# Altium project display.PrjPcb (part 2 of 2)

## Sheet wifi.schdoc
size A3; Hw_rev: 0; License: GPLv3; Address3: Firenze; Address4: ITALY; DocumentNumber: 7; Revision: 0; SheetNumber: 7; SheetTotal: 8
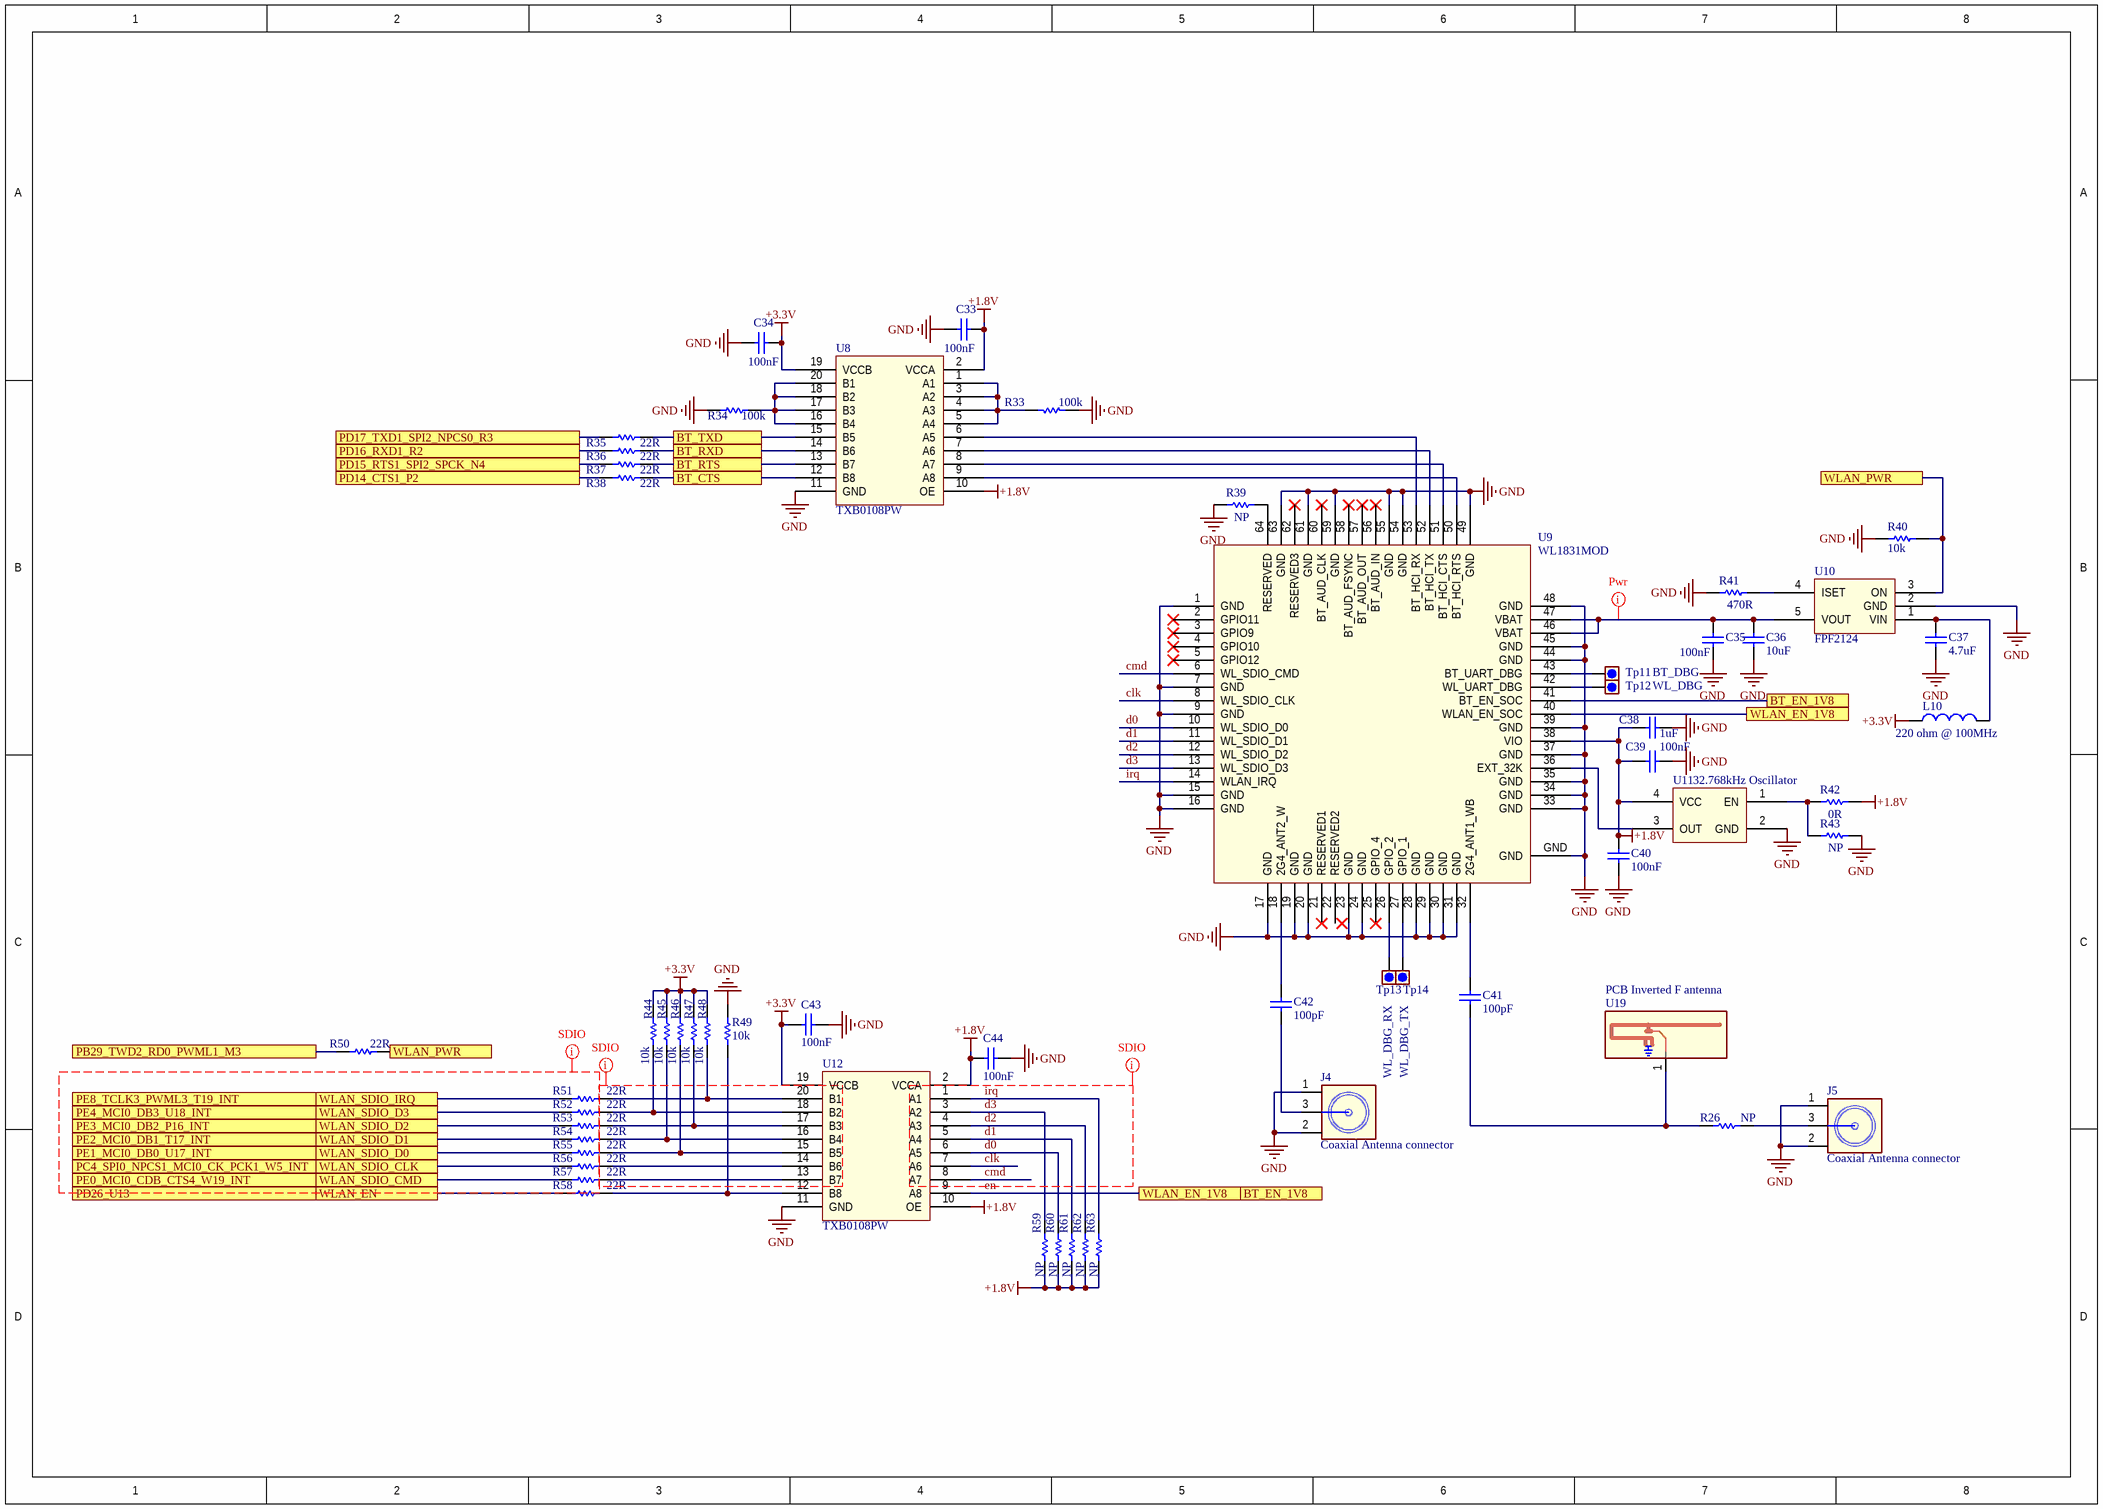
[diagram p5: wifi.schdoc]

### Parts
C33  100nF  [0603_[1608]]
C34  100nF  [0603_[1608]]
C35  100nF  [0603_[1608]]
C36  10uF  [1206_[3216]]
C37  4.7uF  [1206_[3216]]
C38  1uF  [0805_[2012]]
C39  100nF  [0603_[1608]]
C40  100nF  [0603_[1608]]
C41  100pF  [0402_[1005]]
C42  100pF  [0402_[1005]]
C43  100nF  [0603_[1608]]
C44  100nF  [0603_[1608]]
J4  Coaxial Antenna connector  [U.FL_COAXIAL_2.6x2.6MM_STRAIGHT_SMD]
J5  Coaxial Antenna connector  [U.FL_COAXIAL_2.6x2.6MM_STRAIGHT_SMD]
L10  220 ohm @ 100MHz  [0805_[2012]]
R26  NP  [0402_[1005]]
R33  100k  [0603_[1608]]
R34  100k  [0603_[1608]]
R35  22R  [0603_[1608]]
R36  22R  [0603_[1608]]
R37  22R  [0603_[1608]]
R38  22R  [0603_[1608]]
R39  NP  [0603_[1608]]
R40  10k  [0603_[1608]]
R41  470R  [0603_[1608]]
R42  0R  [0603_[1608]]
R43  NP  [0402_[1005]]
R44  10k  [0603_[1608]]
R45  10k  [0603_[1608]]
R46  10k  [0603_[1608]]
R47  10k  [0603_[1608]]
R48  10k  [0603_[1608]]
R49  10k  [0603_[1608]]
R50  22R  [0603_[1608]]
R51  22R  [0603_[1608]]
R52  22R  [0603_[1608]]
R53  22R  [0603_[1608]]
R54  22R  [0603_[1608]]
R55  22R  [0603_[1608]]
R56  22R  [0603_[1608]]
R57  22R  [0603_[1608]]
R58  22R  [0603_[1608]]
R59  NP  [0603_[1608]]
R60  NP  [0603_[1608]]
R61  NP  [0603_[1608]]
R62  NP  [0603_[1608]]
R63  NP  [0603_[1608]]
Tp11  BT_DBG  [TEST_POINT_SMD_D1MM]  (no BOM)
Tp12  WL_DBG  [TEST_POINT_SMD_D1MM]  (no BOM)
Tp13  WL_DBG_RX  [TEST_POINT_SMD_D1MM]  (no BOM)
Tp14  WL_DBG_TX  [TEST_POINT_SMD_D1MM]  (no BOM)
U8  TXB0108PW  [TSOP65P640X120-20L]
U9  WL1831MOD  [WL18XX_E-13.4X13.3-N100_0.75]
U10  FPF2124  [SOT-23-5]
U11  32.768kHz Oscillator  [CRYSTAL_3.2X1.5MM_4P_SMD]
U12  TXB0108PW  [TSOP65P640X120-20L]
U19  PCB Inverted F antenna  [ANTENNA_PCB_IFA]  (no BOM)

### Ports
BT_CTS, BT_EN_1V8, BT_RTS, BT_RXD, BT_TXD, PB29_TWD2_RD0_PWML1_M3, PC4_SPI0_NPCS1_MCI0_CK_PCK1_W5_INT, PD14_CTS1_P2, PD15_RTS1_SPI2_SPCK_N4, PD16_RXD1_R2, PD17_TXD1_SPI2_NPCS0_R3, PD26_U13, PE0_MCI0_CDB_CTS4_W19_INT, PE1_MCI0_DB0_U17_INT, PE2_MCI0_DB1_T17_INT, PE3_MCI0_DB2_P16_INT, PE4_MCI0_DB3_U18_INT, PE8_TCLK3_PWML3_T19_INT, WLAN_EN, WLAN_EN_1V8, WLAN_PWR, WLAN_SDIO_CLK, WLAN_SDIO_CMD, WLAN_SDIO_D0, WLAN_SDIO_D1, WLAN_SDIO_D2, WLAN_SDIO_D3, WLAN_SDIO_IRQ

### Nets
+1.8V: C33.2 C38.2 C39.2 C40.2 C44.2 R42.1 R59.1 R60.1 R61.1 R62.1 R63.1 U8.2(VCCA) U8.10(OE) U9.38(VIO) U11.4(VCC) U12.2(VCCA) U12.10(OE)
+3.3V: C34.2 C43.2 L10.2 R44.1 R45.1 R46.1 R47.1 R48.1 U8.19(VCCB) U12.19(VCCB)
GND: C33.1 C34.1 C35.1 C36.1 C37.1 C38.1 C39.1 C40.1 C43.1 C44.1 J4.1(GND) J4.2(GND) J5.1(GND) J5.2(GND) R33.2 R34.2 R39.2 R40.1 R41.2 R43.1 R49.1 U8.11(GND) U9.1(GND) U9.7(GND) U9.9(GND) U9.15(GND) U9.16(GND) U9.17(GND) U9.19(GND) U9.20(GND) U9.23(GND) U9.24(GND) U9.28(GND) U9.29(GND) U9.30(GND) U9.31(GND) U9.33(GND) U9.34(GND) U9.35(GND) U9.37(GND) U9.39(GND) U9.44(GND) U9.45(GND) U9.48(GND) U9.49(GND) U9.54(GND) U9.55(GND) U9.59(GND) U9.61(GND) U9.63(GND) U9.GND U10.2(GND) U11.2(GND) U12.11(GND)
BT_CTS: R38.2 U8.12(B8) ; port BT_CTS
BT_RTS: R37.2 U8.13(B7) ; port BT_RTS
BT_RXD: R36.2 U8.14(B6) ; port BT_RXD
BT_TXD: R35.2 U8.15(B5) ; port BT_TXD
clk: U9.8(WL_SDIO_CLK) U12.7(A6)
cmd: U9.6(WL_SDIO_CMD) U12.8(A7)
d0: R60.2 U9.10(WL_SDIO_D0) U12.6(A5)
d1: R61.2 U9.11(WL_SDIO_D1) U12.5(A4)
d2: R62.2 U9.12(WL_SDIO_D2) U12.4(A3)
d3: R59.2 U9.13(WL_SDIO_D3) U12.3(A2)
en: U9.40(WLAN_EN_SOC) U9.41(BT_EN_SOC) U12.9(A8) ; port WLAN_EN_1V8, port BT_EN_1V8
irq: R63.2 U9.14(WLAN_IRQ) U12.1(A1)
PB29_TWD2_RD0_PWML1_M3: R50.1 ; port PB29_TWD2_RD0_PWML1_M3
PC4_SPI0_NPCS1_MCI0_CK_PCK1_W5_INT: R56.2 ; port WLAN_SDIO_CLK, port PC4_SPI0_NPCS1_MCI0_CK_PCK1_W5_INT
PD14_CTS1_P2: R38.1 ; port PD14_CTS1_P2
PD15_RTS1_SPI2_SPCK_N4: R37.1 ; port PD15_RTS1_SPI2_SPCK_N4
PD16_RXD1_R2: R36.1 ; port PD16_RXD1_R2
PD17_TXD1_SPI2_NPCS0_R3: R35.1 ; port PD17_TXD1_SPI2_NPCS0_R3
PD26_U13: R58.2 ; port WLAN_EN, port PD26_U13
PE0_MCI0_CDB_CTS4_W19_INT: R57.2 ; port WLAN_SDIO_CMD, port PE0_MCI0_CDB_CTS4_W19_INT
PE1_MCI0_DB0_U17_INT: R55.2 ; port WLAN_SDIO_D0, port PE1_MCI0_DB0_U17_INT
PE2_MCI0_DB1_T17_INT: R54.2 ; port WLAN_SDIO_D1, port PE2_MCI0_DB1_T17_INT
PE3_MCI0_DB2_P16_INT: R53.2 ; port WLAN_SDIO_D2, port PE3_MCI0_DB2_P16_INT
PE4_MCI0_DB3_U18_INT: R52.2 ; port WLAN_SDIO_D3, port PE4_MCI0_DB3_U18_INT
PE8_TCLK3_PWML3_T19_INT: R51.2 ; port WLAN_SDIO_IRQ, port PE8_TCLK3_PWML3_T19_INT
WLAN_PWR: R40.2 R50.2 U10.3(ON) ; port WLAN_PWR
NetC35_2: C35.2 C36.2 U9.46(VBAT) U9.47(VBAT) U10.5(VOUT)
NetC37_2: C37.2 L10.1 U10.1(VIN)
NetC41_1: C41.1 U9.32(2G4_ANT1_WB)
NetC41_2: C41.2 R26.2 U19.1(SIGNAL)
NetC42_1: C42.1 U9.18(2G4_ANT2_W)
NetC42_2: C42.2 J4.3(SIG)
NetJ5_3: J5.3(SIG) R26.1
NetR33_1: R33.1 U8.1(A1) U8.3(A2) U8.4(A3) U8.5(A4)
NetR34_1: R34.1 U8.16(B4) U8.17(B3) U8.18(B2) U8.20(B1)
NetR39_1: R39.1 U9.64(RESERVED)
NetR41_1: R41.1 U10.4(ISET)
NetR42_2: R42.2 R43.2 U11.1(EN)
NetR44_2: R44.2 R52.1 U12.18(B2)
NetR45_2: R45.2 R54.1 U12.16(B4)
NetR46_2: R46.2 R55.1 U12.15(B5)
NetR47_2: R47.2 R53.1 U12.17(B3)
NetR48_2: R48.2 R51.1 U12.20(B1)
NetR49_2: R49.2 R58.1 U12.12(B8)
NetR56_1: R56.1 U12.14(B6)
NetR57_1: R57.1 U12.13(B7)
NetTp11_1: Tp11.1 U9.43(BT_UART_DBG)
NetTp12_1: Tp12.1 U9.42(WL_UART_DBG)
NetTp13_1: Tp13.1 U9.26(GPIO_2)
NetTp14_1: Tp14.1 U9.27(GPIO_1)
NetU8_6: U8.6(A5) U9.53(BT_HCI_RX)
NetU8_7: U8.7(A6) U9.52(BT_HCI_TX)
NetU8_8: U8.8(A7) U9.51(BT_HCI_CTS)
NetU8_9: U8.9(A8) U9.50(BT_HCI_RTS)
NetU9_36: U9.36(EXT_32K) U11.3(OUT)

Not connected (* = marked no-connect by the designer): U9 2(GPIO11)* 3(GPIO9)* 4(GPIO10)* 5(GPIO12)* 21(RESERVED1)* 22(RESERVED2) 25(GPIO_4)* 56(BT_AUD_IN)* 57(BT_AUD_OUT)* 58(BT_AUD_FSYNC)* 60(BT_AUD_CLK)* 62(RESERVED3)*

### Layout directives
net class Power: NetC35_2
net class SDIO_BUS: (no net found under the mark)
net class SDIO: (no net found under the mark)
net class SDIO_LOWBUS: clk, cmd, d0, d1, d2, d3, irq

### Library data of the parts
C33-C35 C38-C40 C43 C44 = Cap: Ceramic X7R 50V; Value: 10nF; Published: 8-Jun-2000; Revision: July-2002: Re-released for DXP Platform.; Publisher: Altium Limited
C36 = Cap: Ceramic X5R 25V; Value: 10nF; Published: 8-Jun-2000; Revision: July-2002: Re-released for DXP Platform.; Publisher: Altium Limited
C37 = Cap: Ceramic X7R 10V; Value: 10nF; Published: 8-Jun-2000; Revision: July-2002: Re-released for DXP Platform.; Publisher: Altium Limited
C41 C42 = Cap: Ceramic COG 50V; Value: 10nF; Published: 8-Jun-2000; Revision: July-2002: Re-released for DXP Platform.; Publisher: Altium Limited
J4 J5 = ANTENNA_3P_COAXIAL_CONNECTOR: U.FL serias
L10 = Inductor: WE 742792022
R26 R33-R63 = Res1: Resistor; Value: 1K; Published: 8-Jun-2000; Revision: July-2002: Re-released for DXP Platform.; Publisher: Altium Limited
Tp11-Tp14 = Test_point: Test point
U8 U12 = TXB0108PW: 8-bit bidirectional level translator
U9 = WL1831MOD: Wifi & Bluethoot module
U10 = FPF2124: Power Load Switch
U11 = Si501/2/3_32768Hz: 32.768kHz Oscillator (EPSON  X1B0002110001 SG-3030CM)
U19 = ANTENNA_PCB_IFA: PCB Antenna

## Sheet ethernet.SchDoc: Ethernet interface
size A3; Hw_rev: 0; License: GPLv3; Address3: Firenze; Address4: ITALY; DocumentNumber: 6; Revision: 0; SheetNumber: 6; SheetTotal: 8
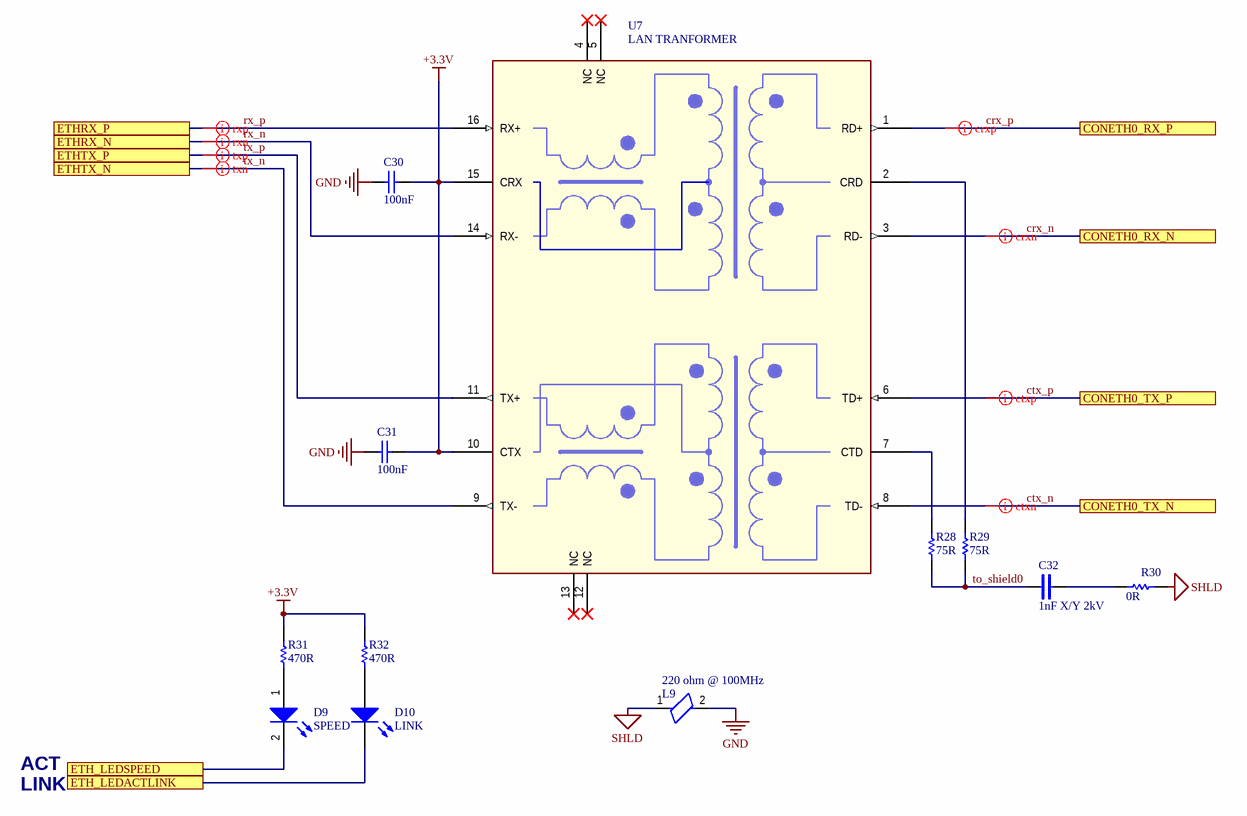
[diagram p6: ethernet.SchDoc]

### Parts
C30  100nF  [0603_[1608]]
C31  100nF  [0603_[1608]]
C32  1nF X/Y 2kV  [1808_[4520]]
D9  SPEED  [0603_[1608]_K2-A1_LED]
D10  LINK  [0603_[1608]_K2-A1_LED]
L9  220 ohm @ 100MHz  [0805_[2012]]
R28  75R  [0603_[1608]]
R29  75R  [0603_[1608]]
R30  0R  [0603_[1608]]
R31  470R  [0603_[1608]]
R32  470R  [0603_[1608]]
U7  LAN TRANFORMER  [LAN_TR_1.27MM_SMD]

### Ports
CONETH0_RX_N, CONETH0_RX_P, CONETH0_TX_N, CONETH0_TX_P, ETH_LEDACTLINK, ETH_LEDSPEED, ETHRX_N, ETHRX_P, ETHTX_N, ETHTX_P

### Nets
+3.3V: C30.2 C31.2 R31.2 R32.2 U7.10(CTX) U7.15(CRX)
GND: C30.1 C31.1 L9.2
SHLD: L9.1 R30.1
crx_n: U7.3(RD-) ; port CONETH0_RX_N
crx_p: U7.1(RD+) ; port CONETH0_RX_P
ctx_n: U7.8(TD-) ; port CONETH0_TX_N
ctx_p: U7.6(TD+) ; port CONETH0_TX_P
ETH_LEDACTLINK: D10.2(K) ; port ETH_LEDACTLINK
ETH_LEDSPEED: D9.2(K) ; port ETH_LEDSPEED
rx_n: U7.14(RX-) ; port ETHRX_N
rx_p: U7.16(RX+) ; port ETHRX_P
to_shield0: C32.1 R28.1 R29.1
tx_n: U7.9(TX-) ; port ETHTX_N
tx_p: U7.11(TX+) ; port ETHTX_P
NetC32_2: C32.2 R30.2
NetD9_1: D9.1(A) R31.1
NetD10_1: D10.1(A) R32.1
NetR28_2: R28.2 U7.7(CTD)
NetR29_2: R29.2 U7.2(CRD)

Not connected (* = marked no-connect by the designer): U7 4(NC)* 5(NC)* 12(NC)* 13(NC)*

### Layout directives
differential pair: crx_n, crx_p, ctx_n, ctx_p, rx_n, rx_p, tx_n, tx_p

### Notes on the sheet
- ACT
- LINK

### Library data of the parts
C30 C31 = Cap: Ceramic X7R 50V; Value: 100pF; Published: 8-Jun-2000; LatestRevisionDate: 17-Jul-2002; LatestRevisionNote: Re-released for DXP Platform.; PackageReference: RAD-0.3; Publisher: Altium Limited; PackageDescription: Radial Cap, Thru-Hole; 2 Leads; 0.3 in Pin Spacing
C32 = cap_xy: CER 250VAC X7R X1/Y1 (GA342DR7GF102KW)
D9 D10 = LED0: LED Green; Published: 8-Jun-2000; LatestRevisionDate: 08-Jul-2005; LatestRevisionNote: Mech Layer 1 removed.; PackageReference: LED-0; Publisher: Altium Limited; PackageDescription: LED; 2 Leads
L9 = BEAD_ FERRITE: WE 742792022
R28 R29 = Res1: Resistor; Revision: July-2002: Re-released for DXP Platform.
R30 = Res1: Resistor; Value: 0; Published: 8-Jun-2000; LatestRevisionDate: 17-Jul-2002; LatestRevisionNote: Re-released for DXP Platform.; PackageReference: AXIAL-0.3; Publisher: Altium Limited; PackageDescription: Axial Device, Thru-Hole; 2 Leads; 0.3 in Pin Spacing
R31 R32 = Res1: Resistor; Value: 1K; Published: 8-Jun-2000; Revision: July-2002: Re-released for DXP Platform.; Publisher: Altium Limited
U7 = LAN-TR-WE7490100111A: Lan transformer (WE 7490100111A (side A); WE 7490100161A (side B))

## Sheet sub-1Ghz_radio.SchDoc: Sub-1GHz Radio Module
size A3; Hw_rev: 0; License: GPLv3; Address3: Firenze; Address4: ITALY; DocumentNumber: 5; Revision: 0; SheetNumber: 5; SheetTotal: 8
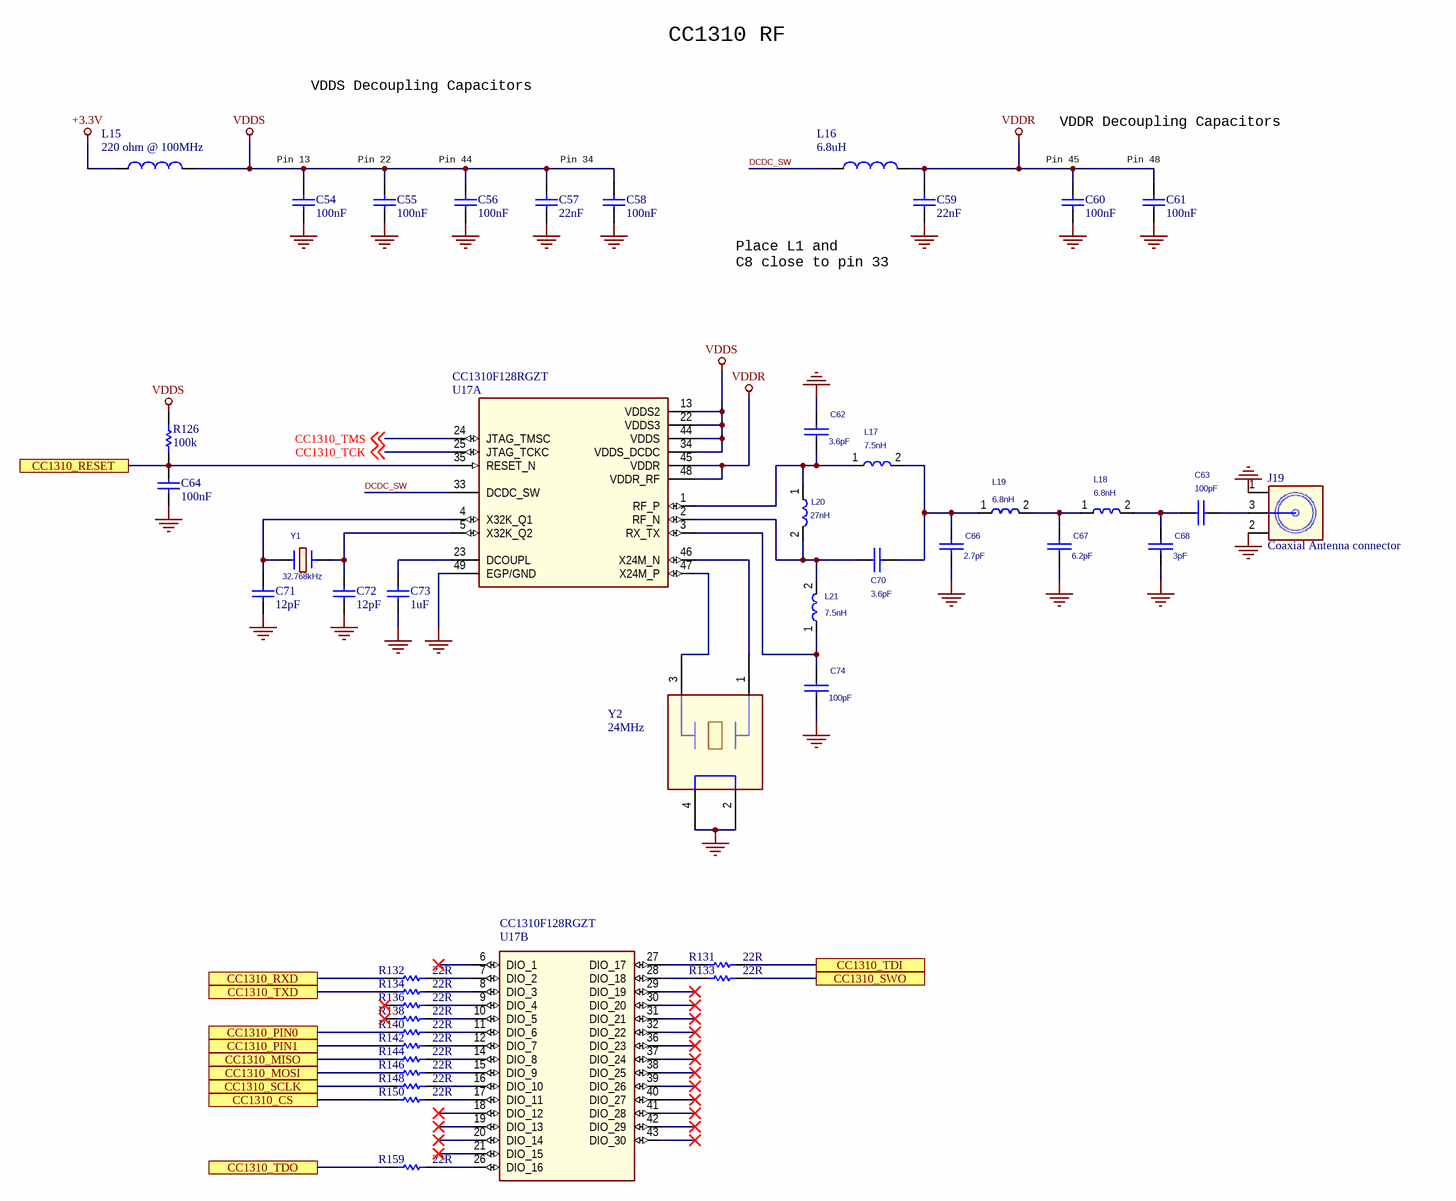
[diagram p7: sub-1Ghz_radio.SchDoc]

### Parts
C54  100nF  [0603_[1608]]
C55  100nF  [0603_[1608]]
C56  100nF  [0603_[1608]]
C57  22nF  [0603_[1608]]
C58  100nF  [0603_[1608]]
C59  22nF  [0603_[1608]]
C60  100nF  [0603_[1608]]
C61  100nF  [0603_[1608]]
C62  3.6pF  [0402_[1005]]
C63  100pF  [0402_[1005]]
C64  100nF  [0603_[1608]]
C66  2.7pF  [0402_[1005]]
C67  6.2pF  [0402_[1005]]
C68  3pF  [0402_[1005]]
C70  3.6pF  [0402_[1005]]
C71  12pF  [0603_[1608]]
C72  12pF  [0603_[1608]]
C73  1uF  [0805_[2012]]
C74  100pF  [0402_[1005]]
J19  Coaxial Antenna connector  [U.FL_COAXIAL_2.6x2.6MM_STRAIGHT_SMD]
L15  220 ohm @ 100MHz  [0805_[2012]]
L16  6.8uH  [0805_[2012]]
L17  7.5nH  [0402_[1005]]
L18  6.8nH  [0402_[1005]]
L19  6.8nH  [0402_[1005]]
L20  27nH  [0402_[1005]]
L21  7.5nH  [0402_[1005]]
R126  100k  [0603_[1608]]
R131  22R  [0603_[1608]]
R132  22R  [0603_[1608]]
R133  22R  [0603_[1608]]
R134  22R  [0603_[1608]]
R136  22R  [0603_[1608]]
R138  22R  [0603_[1608]]
R140  22R  [0603_[1608]]
R142  22R  [0603_[1608]]
R144  22R  [0603_[1608]]
R146  22R  [0603_[1608]]
R148  22R  [0603_[1608]]
R150  22R  [0603_[1608]]
R159  22R  [0603_[1608]]
U17  CC1310F128RGZT  [PQFN50P700X700X100-48N]  (parts A,B of 2)
Y1  32.768kHz  [CRYSTAL_3.2X1.5MM_2P_SMD]
Y2  24MHz  [CRYSTAL_3.2X2.5MM_4P_SMD]

### Ports
CC1310_CS, CC1310_MISO, CC1310_MOSI, CC1310_PIN0, CC1310_PIN1, CC1310_RESET, CC1310_RXD, CC1310_SCLK, CC1310_SWO, CC1310_TDI, CC1310_TDO, CC1310_TXD

### Nets
+3.3V: L15.2
GND: C54.1 C55.1 C56.1 C57.1 C58.1 C59.1 C60.1 C61.1 C62.1 C64.1 C66.2 C67.2 C68.2 C71.1 C72.1 C73.1 C74.2 J19.1(GND) J19.2(GND) U17.49(EGP/GND) Y2.2 Y2.4
VDDR: C59.2 C60.2 C61.2 L16.1 U17.45(VDDR) U17.48(VDDR_RF)
VDDS: C54.2 C55.2 C56.2 C57.2 C58.2 L15.1 R126.1 U17.13(VDDS2) U17.22(VDDS3) U17.34(VDDS_DCDC) U17.44(VDDS)
CC1310_CS: R150.2 ; port CC1310_CS
CC1310_MISO: R144.2 ; port CC1310_MISO
CC1310_MOSI: R146.2 ; port CC1310_MOSI
CC1310_PIN0: R140.2 ; port CC1310_PIN0
CC1310_PIN1: R142.2 ; port CC1310_PIN1
CC1310_RESET: C64.2 R126.2 U17.35(RESET_N) ; port CC1310_RESET
CC1310_RXD: R132.2 ; port CC1310_RXD
CC1310_SCLK: R148.2 ; port CC1310_SCLK
CC1310_SWO: R133.1 ; port CC1310_SWO
CC1310_TCK: U17.25(JTAG_TCKC) ; off-sheet CC1310_TCK
CC1310_TDI: R131.1 ; port CC1310_TDI
CC1310_TDO: R159.2 ; port CC1310_TDO
CC1310_TMS: U17.24(JTAG_TMSC) ; off-sheet CC1310_TMS
CC1310_TXD: R134.2 ; port CC1310_TXD
DCDC_SW: L16.2 U17.33(DCDC_SW)
NetC62_2: C62.2 L17.1 L20.1 U17.1(RF_P)
NetC63_1: C63.1 C68.1 L18.2
NetC63_2: C63.2 J19.3(SIG)
NetC66_1: C66.1 C70.2 L17.2 L19.1
NetC67_1: C67.1 L18.1 L19.2
NetC70_1: C70.1 L20.2 L21.2 U17.2(RF_N)
NetC71_2: C71.2 U17.4(X32K_Q1) Y1.1
NetC72_2: C72.2 U17.5(X32K_Q2) Y1.2
NetC73_2: C73.2 U17.23(DCOUPL)
NetC74_1: C74.1 L21.1 U17.3(RX_TX)
NetR131_2: R131.2 U17.27(DIO_17)
NetR132_1: R132.1 U17.7(DIO_2)
NetR133_2: R133.2 U17.28(DIO_18)
NetR134_1: R134.1 U17.8(DIO_3)
NetR136_1: R136.1 U17.9(DIO_4)
NetR138_1: R138.1 U17.10(DIO_5)
NetR140_1: R140.1 U17.11(DIO_6)
NetR142_1: R142.1 U17.12(DIO_7)
NetR144_1: R144.1 U17.14(DIO_8)
NetR146_1: R146.1 U17.15(DIO_9)
NetR148_1: R148.1 U17.16(DIO_10)
NetR150_1: R150.1 U17.17(DIO_11)
NetR159_1: R159.1 U17.26(DIO_16)
NetU17_46: U17.46(X24M_N) Y2.1
NetU17_47: U17.47(X24M_P) Y2.3

Not connected (* = marked no-connect by the designer): R136 2*; R138 2*; U17 6(DIO_1)* 18(DIO_12)* 19(DIO_13)* 20(DIO_14)* 21(DIO_15)* 29(DIO_19)* 30(DIO_20)* 31(DIO_21)* 32(DIO_22)* 36(DIO_23)* 37(DIO_24)* 38(DIO_25)* 39(DIO_26)* 40(DIO_27)* 41(DIO_28)* 42(DIO_29)* 43(DIO_30)*

### Notes on the sheet
- VDDS Decoupling Capacitors
- CC1310 RF
- VDDR Decoupling Capacitors
- (near C54) Pin 13
- (near C55) Pin 22
- (near C56) Pin 44
- Pin 34
- (near C60) Pin 45
- (near C61) Pin 48
- (near C59) Place L1 and
  C8 close to pin 33

### Library data of the parts
C54-C61 C64 C71-C73 = Cap: Ceramic X7R 50V; Value: 100pF; Published: 8-Jun-2000; LatestRevisionDate: 17-Jul-2002; LatestRevisionNote: Re-released for DXP Platform.; PackageReference: RAD-0.3; Publisher: Altium Limited; PackageDescription: Radial Cap, Thru-Hole; 2 Leads; 0.3 in Pin Spacing
C62 = CAPACITOR: CAPACITOR, CERAMIC C0G/NP0, 3.6pF, 50V, -0.25pF/+0.25pF, -55DEGC/+125DEGC, 0402, SMD; Vendor Part Status: ACTIVE; Vendor Part Number: GRM1555C1H3R6CA01D; Part Number: 02-07631; VOLTAGE: CMAX; CURRENT: CIMAX; KNEE: CBMAX; PSpiceTemplate: C^@REFDES %1 %2 ?TOLERANCE|C^@REFDES| @VALUE ?IC/IC=@IC/ TC=@TC1,@TC2 ?TOLERANCE|\n.model C^@REFDES CAP C=1 DEV=@TOLERANCE%|; DIST: FLAT; SLOPE: CSMAX; MAX_TEMP: CTMAX; TC1: 0; Vendor: MURATA; BU Name: TEXAS INSTRUMENTS NORWAY; Packing Type: TAPE_&_REEL; Packing Size: 10000; Definied Quality: INDUSTRIAL; Budget Currency: EUR; Budget Price: 0.006; Lead Time: 12; NOTE Status: PREFERRED; PCB Package: 0402; Old Footprint: CAPC1005X60N; TC2: 0; Value: 3.6pF; Country of Origin: MISSING INFO; AutoDoc File: https://notefied-dynamic-precision.com/DB/Apps/Desktop/Item/Object.aspx?id=113359; Datasheet URL 2: N/A; Datasheet URL 1: http://psearch.murata.com/capacitor/product/GRM1555C1H3R6CA01%23.pdf; MSL: N/A; MTBF Standard: N/A; MTBF: N/A; Esd Level: N/A; WEIGHT: 0.0016g; Last Time Buy: N/A; LifeCycle Status: ACTIVE; RoHS Status: ROHS_COMPLIANT; MPN Status: ACTIVE; MPN: GRM1555C1H3R6CA01D; Manufacturer: MURATA; Dielectric Type: C0G/NP0; Capacitance: 3.6pF; Rtd Voltage: 50V; Min Tol: -0.25pF; Max Tol: +0.25pF; Min Oper Temp: -55DEGC; Max Oper Temp: +125DEGC; Part Type: CAPACITOR\CERAMIC\0402\STANDARD; Mounting Type: SMD; Revision: R000
C63 C74 = CAPACITOR: Ceramic COG 50V; Vendor Part Status: ACTIVE; Vendor Part Number: GRM1555C1H101JA01D; Part Number: 02-07619; VOLTAGE: CMAX; CURRENT: CIMAX; KNEE: CBMAX; PSpiceTemplate: C^@REFDES %1 %2 ?TOLERANCE|C^@REFDES| @VALUE ?IC/IC=@IC/ TC=@TC1,@TC2 ?TOLERANCE|\n.model C^@REFDES CAP C=1 DEV=@TOLERANCE%|; DIST: FLAT; SLOPE: CSMAX; MAX_TEMP: CTMAX; TC1: 0; Vendor: MURATA; BU Name: TEXAS INSTRUMENTS NORWAY; Packing Type: TAPE_&_REEL; Packing Size: 10000; Definied Quality: INDUSTRIAL; Budget Currency: EUR; Budget Price: 0.004; Lead Time: 12; NOTE Status: PREFERRED; Dielectric Type: C0G/NP0; Min Tol: -5%; Max Tol: +5%; Min Oper Temp: -55DEGC; Max Oper Temp: +125DEGC; PCB Package: 0402; Old Footprint: CAPC1005X60N; TC2: 0; Value: 100pF; Country of Origin: CHINA,PHILIPPINES; AutoDoc File: https://notefied-dynamic-precision.com/DB/Apps/Desktop/Item/Object.aspx?id=113347; Datasheet URL 2: http://search.murata.co.jp/Ceramy/image/img/w_hinm/L0005E.pdf; Datasheet URL 1: http://psearch.murata.com/capacitor/product/GRM1555C1H101JA01%23.pdf; MSL: 1; MTBF Standard: N/A; MTBF: N/A; Esd Level: N/A; WEIGHT: 0.0016g; Last Time Buy: N/A; LifeCycle Status: ACTIVE; RoHS Status: ROHS_COMPLIANT; MPN Status: ACTIVE; MPN: GRM1555C1H101JA01D; Manufacturer: MURATA; Capacitance: 100pF; Rtd Voltage: 50V; Part Type: CAPACITOR\CERAMIC\0402\STANDARD; Mounting Type: SMD; Revision: R000
C66 = CAPACITOR: CAPACITOR, CERAMIC C0G/NP0, 2.7pF, 50V, -0.25pF/+0.25pF, -55DEGC/+125DEGC, 0402, SMD; MPN Status: ACTIVE; MPN: GRM1555C1H2R7CA01D; Manufacturer: MURATA; Part Number: 02-07628; VOLTAGE: CMAX; CURRENT: CIMAX; KNEE: CBMAX; PSpiceTemplate: C^@REFDES %1 %2 ?TOLERANCE|C^@REFDES| @VALUE ?IC/IC=@IC/ TC=@TC1,@TC2 ?TOLERANCE|\n.model C^@REFDES CAP C=1 DEV=@TOLERANCE%|; DIST: FLAT; SLOPE: CSMAX; MAX_TEMP: CTMAX; TC1: 0; Packing Type: TAPE_&_REEL; Packing Size: 10000; Definied Quality: INDUSTRIAL; Budget Currency: EUR; Budget Price: 0.007; Lead Time: 12; NOTE Status: PREFERRED; PCB Package: 0402; Old Footprint: CAPC1005X60N; BU Name: TEXAS INSTRUMENTS NORWAY; TC2: 0; Value: 2.7pF; AutoDoc File: https://notefied-dynamic-precision.com/DB/Apps/Desktop/Item/Object.aspx?id=113356; Datasheet URL 2: http://search.murata.co.jp/Ceramy/image/img/w_hinm/L0005E.pdf; Datasheet URL 1: http://psearch.murata.com/capacitor/product/GRM1555C1H2R7CA01%23.pdf; MSL: 1; MTBF Standard: N/A; MTBF: N/A; Esd Level: N/A; WEIGHT: 0.0016g; Last Time Buy: N/A; LifeCycle Status: ACTIVE; RoHS Status: ROHS_COMPLIANT; Dielectric Type: C0G/NP0; Capacitance: 2.7pF; Rtd Voltage: 50V; Min Tol: -0.25pF; Max Tol: +0.25pF; Min Oper Temp: -55DEGC; Max Oper Temp: +125DEGC; Part Type: CAPACITOR\CERAMIC\0402\STANDARD; Mounting Type: SMD; Revision: R000; Vendor: MURATA; Vendor Part Number: GRM1555C1H2R7CA01D; Vendor Part Status: ACTIVE; Country of Origin: PHILIPPINES
C67 = CAPACITOR: CAPACITOR, CERAMIC C0G/NP0, 6.2pF, 50V, -0.25pF/+0.25pF, -55DEGC/+125DEGC, 0402, SMD; MPN Status: ACTIVE; MPN: GRM1555C1H6R2CA01D; Manufacturer: MURATA; Part Number: 02-07626; VOLTAGE: CMAX; CURRENT: CIMAX; KNEE: CBMAX; PSpiceTemplate: C^@REFDES %1 %2 ?TOLERANCE|C^@REFDES| @VALUE ?IC/IC=@IC/ TC=@TC1,@TC2 ?TOLERANCE|\n.model C^@REFDES CAP C=1 DEV=@TOLERANCE%|; DIST: FLAT; SLOPE: CSMAX; MAX_TEMP: CTMAX; TC1: 0; Packing Type: TAPE_&_REEL; Packing Size: 10000; Definied Quality: INDUSTRIAL; Budget Currency: EUR; Budget Price: 0.007; Lead Time: 14; NOTE Status: PREFERRED; PCB Package: 0402; Old Footprint: CAPC1005X60N; BU Name: TEXAS INSTRUMENTS NORWAY; TC2: 0; Value: 6.2pF; AutoDoc File: https://notefied-dynamic-precision.com/DB/Apps/Desktop/Item/Object.aspx?id=113354; Datasheet URL 2: http://search.murata.co.jp/Ceramy/image/img/w_hinm/L0005E.pdf; Datasheet URL 1: http://psearch.murata.com/capacitor/product/GRM1555C1H6R2CA01%23.pdf; MSL: 1; MTBF Standard: N/A; MTBF: N/A; Esd Level: N/A; WEIGHT: 0.0016g; Last Time Buy: N/A; LifeCycle Status: ACTIVE; RoHS Status: ROHS_COMPLIANT; Dielectric Type: C0G/NP0; Capacitance: 6.2pF; Rtd Voltage: 50V; Min Tol: -0.25pF; Max Tol: +0.25pF; Min Oper Temp: -55DEGC; Max Oper Temp: +125DEGC; Part Type: CAPACITOR\CERAMIC\0402\STANDARD; Mounting Type: SMD; Revision: R000; Vendor: MURATA; Vendor Part Number: GRM1555C1H6R2CA01D; Vendor Part Status: ACTIVE; Country of Origin: PHILIPPINES
C68 = CAPACITOR: CAPACITOR, CERAMIC C0G/NP0, 3pF, 50V, -0.25pF/+0.25pF, -55DEGC/+125DEGC, 0402, SMD; MPN Status: ACTIVE; MPN: GRM1555C1H3R0CA01D; Manufacturer: MURATA; Part Number: 02-07625; VOLTAGE: CMAX; CURRENT: CIMAX; KNEE: CBMAX; PSpiceTemplate: C^@REFDES %1 %2 ?TOLERANCE|C^@REFDES| @VALUE ?IC/IC=@IC/ TC=@TC1,@TC2 ?TOLERANCE|\n.model C^@REFDES CAP C=1 DEV=@TOLERANCE%|; DIST: FLAT; SLOPE: CSMAX; MAX_TEMP: CTMAX; TC1: 0; Packing Type: TAPE_&_REEL; Packing Size: 10000; Definied Quality: INDUSTRIAL; Budget Currency: EUR; Budget Price: 0.006; Lead Time: 16; NOTE Status: PREFERRED; PCB Package: 0402; Old Footprint: CAPC1005X60N; BU Name: TEXAS INSTRUMENTS NORWAY; TC2: 0; Value: 3pF; AutoDoc File: https://notefied-dynamic-precision.com/DB/Apps/Desktop/Item/Object.aspx?id=113353; Datasheet URL 2: http://search.murata.co.jp/Ceramy/image/img/w_hinm/L0005E.pdf; Datasheet URL 1: http://psearch.murata.com/capacitor/product/GRM1555C1H3R0CA01%23.pdf; MSL: 1; MTBF Standard: N/A; MTBF: N/A; Esd Level: N/A; WEIGHT: 0.0016g; Last Time Buy: N/A; LifeCycle Status: ACTIVE; RoHS Status: ROHS_COMPLIANT; Dielectric Type: C0G/NP0; Capacitance: 3pF; Rtd Voltage: 50V; Min Tol: -0.25pF; Max Tol: +0.25pF; Min Oper Temp: -55DEGC; Max Oper Temp: +125DEGC; Part Type: CAPACITOR\CERAMIC\0402\STANDARD; Mounting Type: SMD; Revision: R000; Vendor: MURATA; Vendor Part Number: GRM1555C1H3R0CA01D; Vendor Part Status: ACTIVE; Country of Origin: PHILIPPINES
C70 = CAPACITOR: CAPACITOR, CERAMIC C0G/NP0, 3.6pF, 50V, -0.25pF/+0.25pF, -55DEGC/+125DEGC, 0402, SMD; Vendor Part Status: ACTIVE; Vendor Part Number: GRM1555C1H3R6CA01D; Part Number: 02-07631; VOLTAGE: CMAX; CURRENT: CIMAX; KNEE: CBMAX; PSpiceTemplate: C^@REFDES %1 %2 ?TOLERANCE|C^@REFDES| @VALUE ?IC/IC=@IC/ TC=@TC1,@TC2 ?TOLERANCE|\n.model C^@REFDES CAP C=1 DEV=@TOLERANCE%|; DIST: FLAT; SLOPE: CSMAX; MAX_TEMP: CTMAX; TC1: 0; Vendor: MURATA; BU Name: TEXAS INSTRUMENTS NORWAY; Old Footprint: CAPC1005X60N; PCB Package: 0402; NOTE Status: PREFERRED; Lead Time: 12; Budget Price: 0.006; Budget Currency: EUR; Definied Quality: INDUSTRIAL; Packing Size: 10000; Packing Type: TAPE_&_REEL; TC2: 0; Value: 3.6pF; Country of Origin: MISSING INFO; Revision: R000; Mounting Type: SMD; Part Type: CAPACITOR\CERAMIC\0402\STANDARD; Max Oper Temp: +125DEGC; Min Oper Temp: -55DEGC; Max Tol: +0.25pF; Min Tol: -0.25pF; Rtd Voltage: 50V; Capacitance: 3.6pF; Dielectric Type: C0G/NP0; Manufacturer: MURATA; MPN: GRM1555C1H3R6CA01D; MPN Status: ACTIVE; RoHS Status: ROHS_COMPLIANT; LifeCycle Status: ACTIVE; Last Time Buy: N/A; WEIGHT: 0.0016g; Esd Level: N/A; MTBF: N/A; MTBF Standard: N/A; MSL: N/A; Datasheet URL 1: http://psearch.murata.com/capacitor/product/GRM1555C1H3R6CA01%23.pdf; Datasheet URL 2: N/A; AutoDoc File: https://notefied-dynamic-precision.com/DB/Apps/Desktop/Item/Object.aspx?id=113359
J19 = ANTENNA_3P_COAXIAL_CONNECTOR: U.FL serias
L15 = Inductor: WE 742792022
L16 = Inductor: Inductor WE 742792022
L17 L21 = INDUCTOR: INDUCTOR, RF, CHIP, NON-MAGNETIC CORE, 7.5nH, -5%/+5%, 0.3A, -55DEGC/+125DEGC, 0402, SMD; Part Number: 03-07533; Vendor Part Number: LQG15HS7N5J02D; Vendor Part Status: ACTIVE; DIST: FLAT; DIELECTRIC: DSMAX; PSpiceTemplate: L^@REFDES %1 %2 ?TOLERANCE|L^@REFDES| @VALUE ?IC/IC=@IC/ ?TOLERANCE|\n.model l^@REFDES IND L=1 DEV=@TOLERANCE%|; Current: LMAX; BU Name: TEXAS INSTRUMENTS NORWAY; PCB Package: 0402; Max Tol: +5%; Min Tol: -5%; Resistance: 0.24; Frequency: 4.2GHz; Vendor: MURATA; Lead Time: 10; Budget Price: 0.03; Budget Currency: EUR; Packing Size: 10000; Packing Type: TAPE_&_REEL; Value: 7.5nH; Revision: R000; Mounting Type: SMD; Part Type: INDUCTOR\RF\CHIP\0402; Max Oper Temp: +125DEGC; Min Oper Temp: -55DEGC; Rtd Current: 0.3A; Inductance: 7.5nH; Core Material: NON-MAGNETIC; RoHS Status: ROHS_COMPLIANT; Last Time Buy: N/A; Weight: 0.001g; Country of Origin: MISSING INFO; Datasheet URL 1: http://psearch.murata.com/inductor/product/LQG15HS7N5J02%23.pdf; Datasheet URL 2: N/A; AutoDoc File: https://notefied-dynamic-precision.com/DB/Apps/Desktop/Item/Object.aspx?id=113370
L18 L19 = INDUCTOR: INDUCTOR, RF, CHIP, NON-MAGNETIC CORE, 6.8nH, -5%/+5%, 0.3A, -55DEGC/+125DEGC, 0402, SMD; Vendor Part Status: ACTIVE; Vendor Part Number: LQG15HS6N8J02D; Part Number: 03-07532; DIST: FLAT; DIELECTRIC: DSMAX; PSpiceTemplate: L^@REFDES %1 %2 ?TOLERANCE|L^@REFDES| @VALUE ?IC/IC=@IC/ ?TOLERANCE|\n.model l^@REFDES IND L=1 DEV=@TOLERANCE%|; Current: LMAX; Vendor: MURATA; BU Name: TEXAS INSTRUMENTS NORWAY; Old Footprint: INDC1005X60N; PCB Package: 0402; Max Tol: +5%; Min Tol: -5%; Resistance: 0.24; Frequency: 4.5GHz; NOTE Status: PREFERRED; Lead Time: 9; Budget Price: 0.03; Budget Currency: EUR; Definied Quality: INDUSTRIAL; Packing Size: 10000; Packing Type: TAPE_&_REEL; Value: 6.8nH; Country of Origin: JAPAN,SINGAPORE; Core Material: NON-MAGNETIC; Revision: R000; Mounting Type: SMD; Part Type: INDUCTOR\RF\CHIP\0402; Max Oper Temp: +125DEGC; Min Oper Temp: -55DEGC; Rtd Current: 0.3A; Inductance: 6.8nH; Manufacturer: MURATA; MPN: LQG15HS6N8J02D; MPN Status: ACTIVE; RoHS Status: ROHS_COMPLIANT; LifeCycle Status: ACTIVE; Last Time Buy: N/A; WEIGHT: 0.001g; Esd Level: N/A; MTBF: N/A; MTBF Standard: N/A; MSL: N/A; Datasheet URL 1: http://psearch.murata.com/inductor/product/LQG15HS6N8J02%23.pdf; Datasheet URL 2: N/A; AutoDoc File: https://notefied-dynamic-precision.com/DB/Apps/Desktop/Item/Object.aspx?id=113369
L20 = INDUCTOR: INDUCTOR, RF, CHIP, NON-MAGNETIC CORE, 27nH, -5%/+5%, 0.3A, -55DEGC/+125DEGC, 0402, SMD; Vendor Part Status: ACTIVE; Vendor Part Number: LQG15HS27NJ02D; Part Number: 03-07528; DIST: FLAT; DIELECTRIC: DSMAX; PSpiceTemplate: L^@REFDES %1 %2 ?TOLERANCE|L^@REFDES| @VALUE ?IC/IC=@IC/ ?TOLERANCE|\n.model l^@REFDES IND L=1 DEV=@TOLERANCE%|; Current: LMAX; Vendor: MURATA; BU Name: TEXAS INSTRUMENTS NORWAY; Old Footprint: INDC1005X60N; PCB Package: 0402; Max Tol: +5%; Min Tol: -5%; Resistance: 0.46; Frequency: 1700MHz; NOTE Status: PREFERRED; Lead Time: 9; Budget Price: 0.03; Budget Currency: EUR; Definied Quality: INDUSTRIAL; Packing Size: 10000; Packing Type: TAPE_&_REEL; Value: 27nH; Country of Origin: JAPAN,SINGAPORE; Core Material: NON-MAGNETIC; Revision: R000; Mounting Type: SMD; Part Type: INDUCTOR\RF\CHIP\0402; Max Oper Temp: +125DEGC; Min Oper Temp: -55DEGC; Rtd Current: 0.3A; Inductance: 27nH; Manufacturer: MURATA; MPN: LQG15HS27NJ02D; MPN Status: ACTIVE; RoHS Status: ROHS_COMPLIANT; LifeCycle Status: ACTIVE; Last Time Buy: N/A; WEIGHT: 0.001g; Esd Level: N/A; MTBF: N/A; MTBF Standard: N/A; MSL: N/A; Datasheet URL 1: http://psearch.murata.com/inductor/product/LQG15HS27NJ02%23.pdf; Datasheet URL 2: N/A; AutoDoc File: https://notefied-dynamic-precision.com/DB/Apps/Desktop/Item/Object.aspx?id=113365
R126 R131-R134 R136 R138 R140 R142 R144 R146 R148 R150 R159 = Res1: Resistor; Value: 1K; Published: 8-Jun-2000; Revision: July-2002: Re-released for DXP Platform.; Publisher: Altium Limited
U17 = CC1310F128RGZT_VQFN48: Texas CC1310 RF Cpu; CLASS: IC; SWAP_INFO: (S1+S2); SPLIT_INST: TRUE; Designed_By: Artur Bielinski; Design_Date: 2015-11-27
Y1 = CRYSTAL: CRYSTAL, RESONATOR, 32.768kHz, -20PPM/+20PPM, -40DEGC/+85DEGC, SMD; MPN Status: ACTIVE; MPN: FC-135 32.7680KA-AG0; Manufacturer: EPSON; Part Number: 12-00546; Packing Type: TAPE_&_REEL; Packing Size: 1000; Definied Quality: INDUSTRIAL; Budget Currency: USD; Budget Price: 1.25375; Lead Time: 10; NOTE Status: PREFERRED; Capacitance: 7pF; Min Tol: -20PPM; Max Tol: +20PPM; Old Footprint: XTAL_FC-135N; ALT_SYMBOLS: XTAL_FC-135L,XTAL_FC-135M; FPLIST: XTAL_FC-135N,XTAL_FC-135L,XTAL_FC-135M; AutoDoc File: http://notefied-dynamic-precision.com/DB/Apps/Desktop/Item/Object.aspx?id=91966; Datasheet URL 2: http://www.eea.epson.com/portal/pls/portal/docs/1/1525451.PDF; Datasheet URL 1: http://www.eea.epson.com/portal/pls/portal/docs/1/1525528.PDF; MSL: N/A; MTBF Standard: N/A; MTBF: N/A; Esd Level: N/A; WEIGHT: N/A; Last Time Buy: N/A; RoHS Status: ROHS_COMPLIANT; Frequency: 32.768kHz; Min Oper Temp: -40DEGC; Max Oper Temp: +85DEGC; Part Type: CRYSTAL\OSCILLATOR\MEMS; Mounting Type: SMD; Revision: R001
Y2 = CRYSTAL-4p: Crystal

## Nets that join several sheets
+1.8V: supply (5 pins), wifi (17 pins)
+3.3V: connector (12 pins), develboard (L1.1), display (16 pins), supply (7 pins), sensor_output (C52.2 R102.1 R103.1 U15.2), wifi (10 pins), ethernet (6 pins), sub-1Ghz_radio (L15.2)
+5V: connector (J14.16 R80.2 R83.2), display (C3.2 C4.2 L2.2 U2.1), supply (6 pins), sensor_output (7 pins)
+24V: connector (D14.1 U14.T2), supply (7 pins)
GND: connector (19 pins), develboard (12 pins), display (38 pins), supply (35 pins), sensor_output (13 pins), wifi (54 pins), ethernet (C30.1 C31.1 L9.2), sub-1Ghz_radio (22 pins)
SHLD: connector (5 pins), supply (7 pins), ethernet (L9.1 R30.1)
VBatt: develboard (U1.126), supply (5 pins)
1-wire-temp: connector (5 pins), sensor_output (U16.2)
CC1310_CS: develboard (R152.1), display (R127.2), sub-1Ghz_radio (R150.2)
CC1310_MISO: develboard (R147.1), sub-1Ghz_radio (R144.2)
CC1310_MOSI: develboard (R149.1), display (R135.2), sub-1Ghz_radio (R146.2)
CC1310_PIN0: develboard (R143.1), display (R24.2), sub-1Ghz_radio (R140.2)
CC1310_PIN1: develboard (R145.1), display (R109.2), sub-1Ghz_radio (R142.2)
CC1310_RESET: connector (D3.1 J16.1), develboard (U1.161), sub-1Ghz_radio (C64.2 R126.2 U17.35)
CC1310_RXD: connector (J11.1 R77.1), develboard (U1.102), sub-1Ghz_radio (R132.2)
CC1310_SCLK: develboard (R151.1), display (R130.2), sub-1Ghz_radio (R148.2)
CC1310_SWO: connector (J11.5), sub-1Ghz_radio (R133.1)
CC1310_TCK: connector (J11.4), sub-1Ghz_radio (U17.25)
CC1310_TDI: connector (J11.6), sub-1Ghz_radio (R131.1)
CC1310_TDO: connector (J11.7), sub-1Ghz_radio (R159.2)
CC1310_TMS: connector (J11.3), sub-1Ghz_radio (U17.24)
CC1310_TXD: connector (J11.2 R79.1), develboard (U1.107), sub-1Ghz_radio (R134.2)
crx_n: connector (J6.2), ethernet (U7.3)
crx_p: connector (J6.1), ethernet (U7.1)
ctx_n: connector (J6.4), ethernet (U7.8)
ctx_p: connector (J6.3), ethernet (U7.6)
EINK_RTS: develboard (U1.158), display (R108.2)
ETH_LEDACTLINK: develboard (U1.77), ethernet (D10.2)
ETH_LEDSPEED: develboard (U1.76), ethernet (D9.2)
PA0_LCDDAT0_TMS_A7: develboard (U1.61), display (J1.21)
PA1_LCDDAT1_F6: develboard (U1.51), display (J1.22)
PA2_LCDDAT2_G1_TXCK_E6: develboard (U1.53), display (J1.23)
PA3_LCDDAT3_G1_RXCK_C6: develboard (U1.57), display (J1.24)
PA4_LCDDAT4_G1_TXEN_D6: develboard (U1.55), display (J1.25)
PA5_LCDDAT5_G1_TXER_B6: develboard (U1.59), display (J1.26)
PA6_LCDDAT6_G1_CRS_A6: develboard (U1.62), display (J1.27)
PA7_LCDDAT7_E5: develboard (U1.50), display (J1.28)
PA8_LCDDAT8_TCK_A5: develboard (U1.65), display (J1.13)
PA9_LCDDAT9_G1_COL_F4: develboard (U1.72), display (J1.14)
PA10_LCDDAT10_G1_RXDV_F5: develboard (U1.49), display (J1.15)
PA11_LCDDAT11_G1_RXER_D5: develboard (U1.54), display (J1.16)
PA12_LCDDAT12_G1_RX0_G5: develboard (U1.47), display (J1.17)
PA13_LCDDAT13_G1_RX1_C5: develboard (U1.58), display (J1.18)
PA14_LCDDAT14_G1_TX0_E4: develboard (U1.52), display (J1.19)
PA15_LCDDAT15_G1_TX1_B5: develboard (U1.60), display (J1.20)
PA16_LCDDAT16_NTRST_H6: develboard (U1.48), display (J1.5)
PA17_LCDDAT17_D4: develboard (U1.71), display (J1.6)
PA18_LCDDAT18_G1_RX2_G4: develboard (U1.75), display (J1.7)
PA19_LCDDAT19_G1_RX3_C4: develboard (U1.68), display (J1.8)
PA20_LCDDAT20_G1_TX2_A3: develboard (U1.69), display (J1.9)
PA21_LCDDAT21_G1_TX3_B4: develboard (U1.66), display (J1.10)
PA22_LCDDAT22_G1_MDC_B3: develboard (U1.70), display (J1.11)
PA23_LCDDAT23_G1_MDIO_A4: develboard (U1.67), display (J1.12)
PA24_LCDPWM_PCK0_H5: develboard (U1.45), display (R4.2 R5.1)
PA25_LCDDISP_TD0_F3: develboard (U1.73), display (J1.31)
PA26_LCDVSYNC_PWMH0_SP1_NPCS1_E3: develboard (U1.56), display (J1.33)
PA27_LCDHSYNC_PWML0_SPI1_NPCS2_H4: develboard (U1.44), display (J1.32)
PA28_LCDPCK_PWMH1_SP1_NPCS3_G3: develboard (U1.74), display (J1.30)
PA29_LCDDEN_PWML1_J5: develboard (U1.46), display (J1.34)
PA30_TWD0_D3: develboard (U1.140), sensor_output (R104.2)
PA31_TWCK0_J4: develboard (U1.139), sensor_output (R105.2)
PB14_G0_TX2_SPI2_NPCS1_PWMH0_A1: develboard (U1.97), sensor_output (R123.2 R125.2)
PB15_G0_TX3_SPI2_NPCS2_PWML0_E2: connector (R76.2), develboard (U1.99)
PB18_SPI1_MISO_K2: connector (J14.8), develboard (U1.110)
PB19_SPI1_MOSI_C1: connector (J14.11), develboard (U1.95)
PB20_SPI1_SPCK__D1: connector (J14.10), develboard (U1.96)
PB21_SPI1_NPCS0_L3: connector (J14.6), develboard (U1.111)
PB27_SPI1_NPCS3_TK0_PWML0_L2: develboard (U1.113), sensor_output (R120.2)
PB28_SPI2_NPCS3_TD0_PWMH1_K1: develboard (U1.109), sensor_output (R116.2 R122.2 R124.2)
PB29_TWD2_RD0_PWML1_M3: develboard (U1.137), wifi (R50.1)
PB31_TF0_L1: develboard (U1.112), sensor_output (R118.2)
PC4_SPI0_NPCS1_MCI0_CK_PCK1_W5_INT: develboard (U1.138), wifi (R56.2)
PC19_ISI_D0_TK1_U14: develboard (U1.7), display (R15.2)
PC20_ISI_D1_TF1_V11: connector (S2.R4 S3.R4), develboard (U1.3)
PC21_ISI_D2_TD1_U15: develboard (U1.8), display (R16.2)
PC23_ISI_D4_RD1_U16: connector (R101.2), develboard (U1.10)
PC27_AD0_SPI0_NPCS1_PWML0_U12: develboard (U1.136), display (R11.2 R12.2)
PC28_AD1_SPI0_NPCS2_PWML1_T11: develboard (U1.134), display (R7.2 R8.2)
PC29_AD2_SPI0_NPCS3_PWMFI0_R13: develboard (U1.16), display (R13.2 R14.2)
PC30_AD3_PWMH0_T12: develboard (U1.1), display (R9.2 R10.2)
PC31_AD4_PWMH1_T13: connector (S2.P2 S3.P2), develboard (U1.6)
PD11_RTS0_SPI2_MISO_N3: connector (R67.2 R73.2 U13.3), develboard (U1.119)
PD12_RXD0_N1: connector (R65.2), develboard (U1.117)
PD13_TXD0_SPI2_MOSI_P3: connector (R70.2), develboard (U1.120)
PD14_CTS1_P2: develboard (U1.130), wifi (R38.1)
PD15_RTS1_SPI2_SPCK_N4: develboard (U1.155), wifi (R37.1)
PD16_RXD1_R2: develboard (U1.127), wifi (R36.1)
PD17_TXD1_SPI2_NPCS0_R3: develboard (U1.128), wifi (R35.1)
PD19_P11: connector (S2.R8 S3.R8), develboard (U1.168)
PD21_P10: connector (S2.R2 S3.R2), develboard (U1.165)
PD22_U11: connector (S2.R5 S3.R5), develboard (U1.4)
PD23_R10: connector (S2.R1 S3.R1), develboard (U1.166)
PD24_U10: connector (S2.R7 S3.R7), develboard (U1.167)
PD25_R11: connector (S2.R6 S3.R6), develboard (U1.5)
PD26_U13: develboard (U1.133), wifi (R58.2)
PD28_SCK0_R1: develboard (U1.122), sensor_output (R107.2)
PD31_SPI0_NPCS2_PCK1_P5: connector (S2.R3 S3.R3), develboard (U1.156)
PE0_MCI0_CDB_CTS4_W19_INT: develboard (U1.28), wifi (R57.2)
PE1_MCI0_DB0_U17_INT: develboard (U1.23), wifi (R55.2)
PE2_MCI0_DB1_T17_INT: develboard (U1.26), wifi (R54.2)
PE3_MCI0_DB2_P16_INT: develboard (U1.12), wifi (R53.2)
PE4_MCI0_DB3_U18_INT: develboard (U1.19), wifi (R52.2)
PE8_TCLK3_PWML3_T19_INT: develboard (U1.24), wifi (R51.2)
PE10_TIOB2_N14: connector (R84.2), develboard (U1.164)
PE16_RXD3_TIOB0_M15: connector (R68.1), develboard (U1.14)
PE17_TXD3_TCLK0_N19: connector (R69.1), develboard (U1.38)
PE18_TIOA5_MCI1_CK_P19: connector (R97.1), develboard (U1.35)
PE19_TIOB5_MCI1_CDA_N16: connector (R98.1), develboard (U1.18)
PE20_TCLK5_MCI1_DA0_M14: connector (R95.1), develboard (U1.13)
PE21_TIOA4_MCI1_DA1_M18: connector (R93.1), develboard (U1.41)
PE22_TIOB4_MCI1_DA2_M19: connector (R100.1), develboard (U1.40)
PE23_TCLK4_MCI_DA3_L18: connector (R99.1), develboard (U1.43)
PE29_DIBP_URXD0_TWD1_V1: connector (J14.13), develboard (U1.123), display (R18.2 R19.2)
PE30_DIBN_UTXD0_TWCK1_U2: connector (J14.12), develboard (U1.125), display (R17.2 R20.2)
PWMH0: connector (J14.9), sensor_output (R125.1)
PWMH1: connector (J14.1), sensor_output (R124.1)
RESET: connector (R75.2), develboard (U1.149)
ROTARY_LED1: connector (S2.L2 S3.L2), develboard (U1.9)
rx_n: develboard (U1.78), ethernet (U7.14)
rx_p: develboard (U1.79), ethernet (U7.16)
TD: connector (J14.2), sensor_output (R117.1)
TF: connector (J14.4), sensor_output (R119.1)
TK: connector (J14.3), sensor_output (R121.1)
tx_n: develboard (U1.80), ethernet (U7.9)
tx_p: develboard (U1.81), ethernet (U7.11)
VIN+: connector (J8.2), supply (C12.2 C65.1 D1.AC2 Tp1.1)
VIN-: connector (J8.3), supply (C12.1 C69.2 D1.AC1 Tp2.1)